# Altium schematic sheet 15-SDRAM_Flash.SchDoc
size B; SheetNumber: 15; SheetTotal: 16
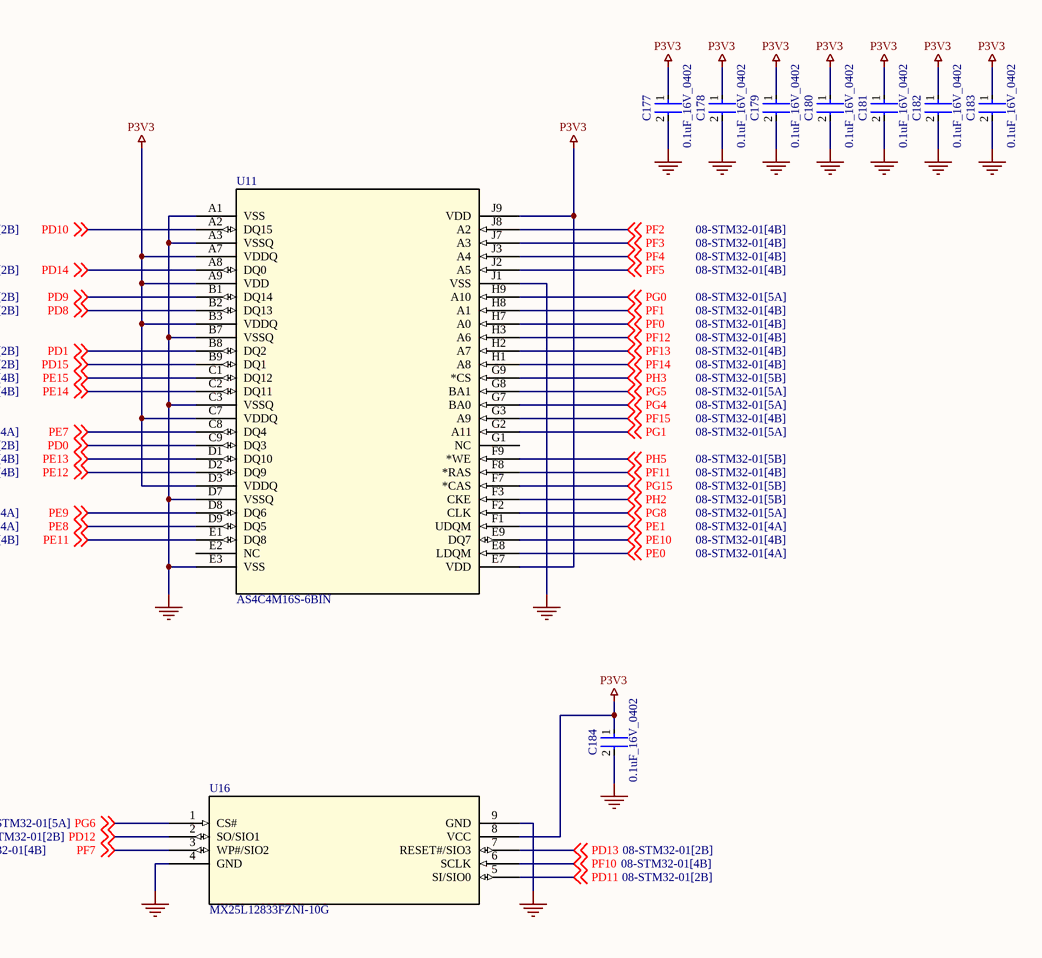
[diagram p0: 15-SDRAM_Flash.SchDoc]

## Parts
C177  0.1uF_16V_0402  [FP-C0402-BB-MFG]
C178  0.1uF_16V_0402  [FP-C0402-BB-MFG]
C179  0.1uF_16V_0402  [FP-C0402-BB-MFG]
C180  0.1uF_16V_0402  [FP-C0402-BB-MFG]
C181  0.1uF_16V_0402  [FP-C0402-BB-MFG]
C182  0.1uF_16V_0402  [FP-C0402-BB-MFG]
C183  0.1uF_16V_0402  [FP-C0402-BB-MFG]
C184  0.1uF_16V_0402  [FP-C0402-BB-MFG]
U11  AS4C4M16S-6BIN  [TFBGA-54_8X8_ALL]
U16  MX25L12833FZNI-10G  [WSON8_6X5X0p8_MAC]

## Nets
GND: C177.2 C178.2 C179.2 C180.2 C181.2 C182.2 C183.2 C184.2 U11.A1(VSS) U11.A3(VSSQ) U11.B7(VSSQ) U11.C3(VSSQ) U11.D7(VSSQ) U11.E3(VSS) U11.J1(VSS) U16.4(GND) U16.9(GND)
P3V3: C177.1 C178.1 C179.1 C180.1 C181.1 C182.1 C183.1 C184.1 U11.A7(VDDQ) U11.A9(VDD) U11.B3(VDDQ) U11.C7(VDDQ) U11.D3(VDDQ) U11.E7(VDD) U11.J9(VDD) U16.8(VCC)
PD0: U11.C9(DQ3) ; off-sheet PD0
PD1: U11.B8(DQ2) ; off-sheet PD1
PD8: U11.B2(DQ13) ; off-sheet PD8
PD9: U11.B1(DQ14) ; off-sheet PD9
PD10: U11.A2(DQ15) ; off-sheet PD10
PD11: U16.5(SI/SIO0) ; off-sheet PD11
PD12: U16.2(SO/SIO1) ; off-sheet PD12
PD13: U16.7(RESET#/SIO3) ; off-sheet PD13
PD14: U11.A8(DQ0) ; off-sheet PD14
PD15: U11.B9(DQ1) ; off-sheet PD15
PE0: U11.E8(LDQM) ; off-sheet PE0
PE1: U11.F1(UDQM) ; off-sheet PE1
PE7: U11.C8(DQ4) ; off-sheet PE7
PE8: U11.D9(DQ5) ; off-sheet PE8
PE9: U11.D8(DQ6) ; off-sheet PE9
PE10: U11.E9(DQ7) ; off-sheet PE10
PE11: U11.E1(DQ8) ; off-sheet PE11
PE12: U11.D2(DQ9) ; off-sheet PE12
PE13: U11.D1(DQ10) ; off-sheet PE13
PE14: U11.C2(DQ11) ; off-sheet PE14
PE15: U11.C1(DQ12) ; off-sheet PE15
PF0: U11.H7(A0) ; off-sheet PF0
PF1: U11.H8(A1) ; off-sheet PF1
PF2: U11.J8(A2) ; off-sheet PF2
PF3: U11.J7(A3) ; off-sheet PF3
PF4: U11.J3(A4) ; off-sheet PF4
PF5: U11.J2(A5) ; off-sheet PF5
PF7: U16.3(WP#/SIO2) ; off-sheet PF7
PF10: U16.6(SCLK) ; off-sheet PF10
PF11: U11.F8(*RAS) ; off-sheet PF11
PF12: U11.H3(A6) ; off-sheet PF12
PF13: U11.H2(A7) ; off-sheet PF13
PF14: U11.H1(A8) ; off-sheet PF14
PF15: U11.G3(A9) ; off-sheet PF15
PG0: U11.H9(A10) ; off-sheet PG0
PG1: U11.G2(A11) ; off-sheet PG1
PG4: U11.G7(BA0) ; off-sheet PG4
PG5: U11.G8(BA1) ; off-sheet PG5
PG6: U16.1(CS#) ; off-sheet PG6
PG8: U11.F2(CLK) ; off-sheet PG8
PG15: U11.F7(*CAS) ; off-sheet PG15
PH2: U11.F3(CKE) ; off-sheet PH2
PH3: U11.G9(*CS) ; off-sheet PH3
PH5: U11.F9(*WE) ; off-sheet PH5

Not connected (* = marked no-connect by the designer): U11 E2(NC) G1(NC)

## Library data of the parts
C177-C184 = CMP-1034-02068-3: CAP CER 0.1UF 16V 5% X7R 0402; Manufacturer: Kemet; Manufacturer Part Number: C0402C104J4RACTU; Value: 0.10 μF; Temperature Coefficient: 15%; Tolerance: 0.05; Material: Ceramic; ComponentLink2URL: https://content.kemet.com/datasheets/KEM_C1002_X7R_SMD.pdf; Automotive: No; Device Class L2: Capacitors; Temperature: -55°C to +125°C; RoHS: TRUE; Voltage Rating: 16 V; ComponentLink2Description: Datasheet; Device Class L3: Ceramic Capacitors; Temperature Range Low: -55°C; Ipc Land Pattern Name: CAPC10050X50; Device Class L1: Passive Components; Temperature Range High: +125°C; Package: C0402-BB; Capacitance: 0.10 μF; Category: Cap; Mouser Description: CAP CER 0.1UF 16V X7R 0402; Height: 0.55mm; Digikey Description: CAP CER 0.1UF 16V 5% X7R 0402; Octopart: https://octopart.com/c0402c104j4ractu-kemet-12573893; Temperature Characteristic: X7R; Lead Free: Yes
U11 = AS4C4M16S-6BIN: No Description Available; Mfr_Name: Alliance Memory; Copyright: Copyright (C) 2023 Ultra Librarian. All rights reserved.; Manufacturer_Part_Number: AS4C4M16S-6BIN; RefDes: RefDes; Type: DEV
U16 = MX25L12833FZNI-10G: No Description Available; Mfr_Name: Macronix; Copyright: Copyright (C) 2023 Ultra Librarian. All rights reserved.; Manufacturer_Part_Number: MX25L12833FZNI-10G; RefDes: RefDes; Type: DEV